# EAGLE design DummyLoad (EAGLE 7.3.0)
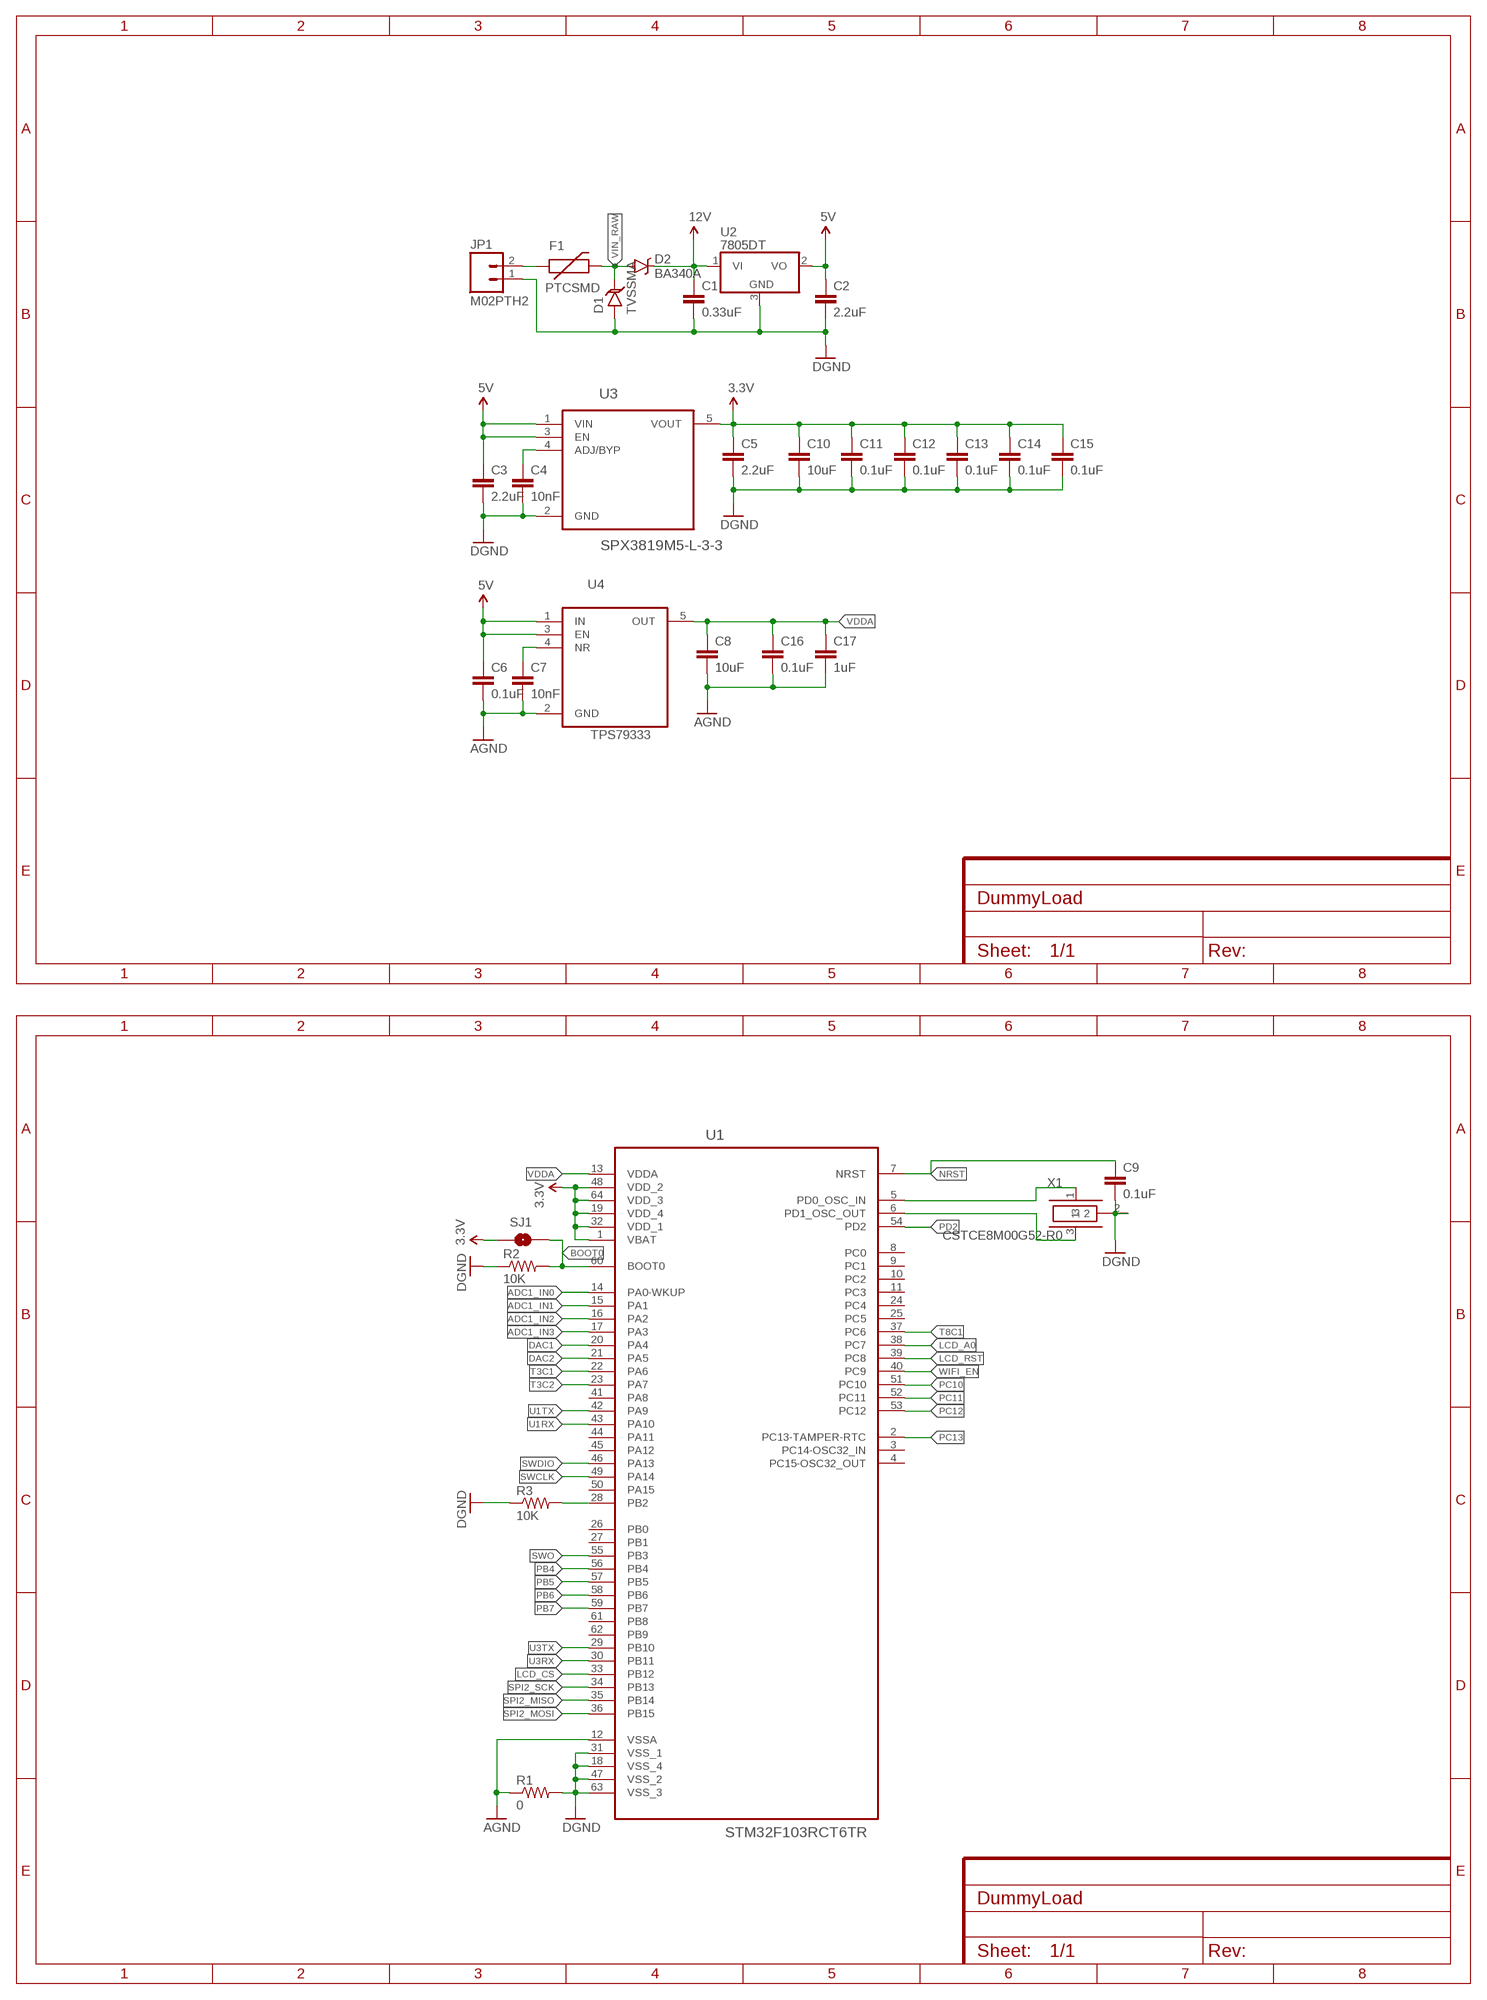
[diagram p0: schematic, sheet 1, part 1 of 2]
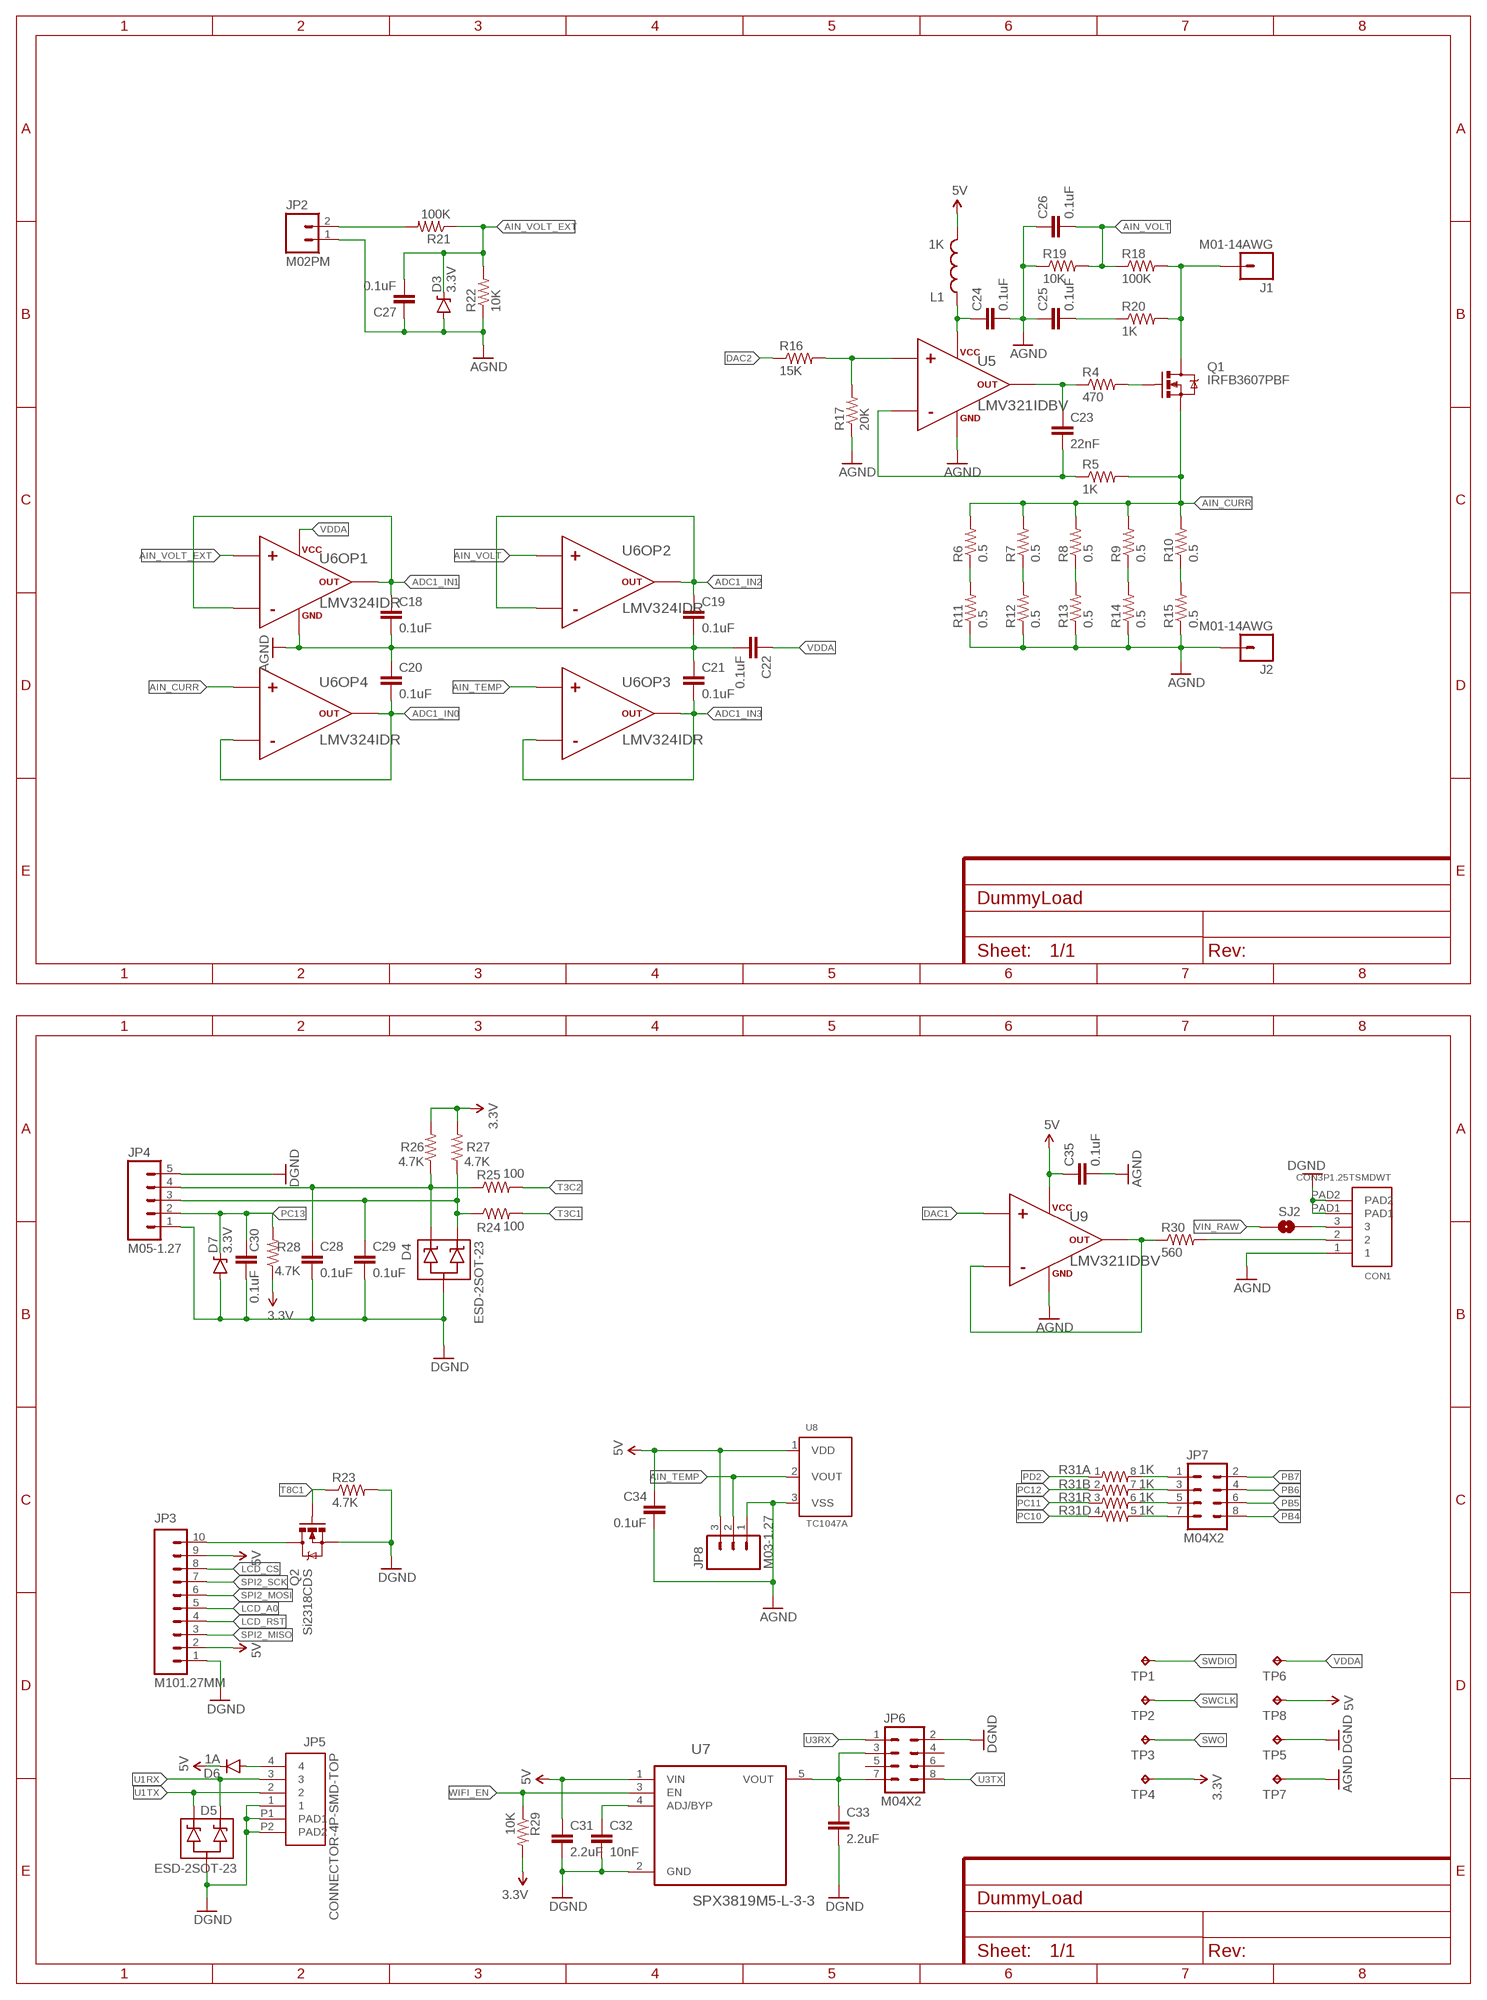
[diagram p1: schematic, sheet 1, part 2 of 2]
FRAME1 (FRAME-A4L): CNAME: Power Supply
FRAME2 (FRAME-A4L): CNAME: STM32F103
FRAME3 (FRAME-A4L): CNAME: OpAmp & Load
FRAME4 (FRAME-A4L): CNAME: Connectors

## Parts
C1  0.33uF  CAP0603-CAP  [0603-CAP]
C2  2.2uF  CAP0603-CAP  [0603-CAP]
C3  2.2uF  CAP0603-CAP  [0603-CAP]
C4  10nF  CAP0603-CAP  [0603-CAP]
C5  2.2uF  CAP0603-CAP  [0603-CAP]
C6  0.1uF  CAP0603-CAP  [0603-CAP]
C7  10nF  CAP0603-CAP  [0603-CAP]
C8  10uF  CAP0603-CAP  [0603-CAP]
C9  0.1uF  CAP0603-CAP  [0603-CAP]
C10  10uF  CAP0603-CAP  [0603-CAP]
C11  0.1uF  CAP0603-CAP  [0603-CAP]
C12  0.1uF  CAP0603-CAP  [0603-CAP]
C13  0.1uF  CAP0603-CAP  [0603-CAP]
C14  0.1uF  CAP0603-CAP  [0603-CAP]
C15  0.1uF  CAP0603-CAP  [0603-CAP]
C16  0.1uF  CAP0603-CAP  [0603-CAP]
C17  1uF  CAP0603-CAP  [0603-CAP]
C18  0.1uF  CAP0603-CAP  [0603-CAP]
C19  0.1uF  CAP0603-CAP  [0603-CAP]
C20  0.1uF  CAP0603-CAP  [0603-CAP]
C21  0.1uF  CAP0603-CAP  [0603-CAP]
C22  0.1uF  CAP0603-CAP  [0603-CAP]
C23  22nF  CAP0603-CAP  [0603-CAP]
C24  0.1uF  CAP0603-CAP  [0603-CAP]
C25  0.1uF  0.1UF-25V-5%(0603)  [0603-CAP]
C26  0.1uF  0.1UF-25V-5%(0603)  [0603-CAP]
C27  0.1uF  0.1UF-25V-5%(0603)  [0603-CAP]
C28  0.1uF  CAP0603-CAP  [0603-CAP]
C29  0.1uF  CAP0603-CAP  [0603-CAP]
C30  0.1uF  CAP0603-CAP  [0603-CAP]
C31  2.2uF  CAP0603-CAP  [0603-CAP]
C32  10nF  CAP0603-CAP  [0603-CAP]
C33  2.2uF  CAP0603-CAP  [0603-CAP]
C34  0.1uF  CAP0603-CAP  [0603-CAP]
C35  0.1uF  CAP0603-CAP  [0603-CAP]
CON1  CON3P1.25TSMDWT  [1.25T3P]
D1  TVSSMA  [SMA-DIODE]
D2  BA340A  B340A  [SMA-DIODE]
D3  3.3V  DIODE-ZENER3.3V  [SOD-323]
D4  ESD-2SOT-23  [SOT23-3]
D5  ESD-2SOT-23  [SOT23-3]
D6  1A  DIODESOD123  [SOD-123]
D7  3.3V  DIODE-ZENER3.3V  [SOD-323]
F1  PTCSMD  [PTC-1206]
J1  M01-14AWG  [PTH1.8MM]
J2  M01-14AWG  [PTH1.8MM]
JP1  M02PTH2  [1X02_BIG]
JP2  M02PM  [1X02_PM]
JP3  M101.27MM  [1X10-1.27MM]
JP4  M05-1.27  M051.27MM  [1X05-1.27MM]
JP5  CONNECTOR-4P-SMD-TOP  [PH2-4T]
JP6  M04X2  [2X4]
JP7  M04X2  [2X4]
JP8  M03-1.27  M03M03-1.27MM  [1X03-1.27MM]
L1  1K  INDUCTOR0603  [0603]
Q1  IRFB3607PBF  MOSFET-NCHANNELFQP30N06L  [TO220V]
Q2  Si2318CDS  MOSFET-NCHANNELBSS123LT1G  [SOT23-3]
R1  0  0OHM-1/10W-5%(0603)  [0603]
R2  10K  RESISTOR0603-RES  [0603-RES]
R3  10K  RESISTOR0603-RES  [0603-RES]
R4  470  RESISTOR0603-RES  [0603-RES]
R5  1K  RESISTOR0603-RES  [0603-RES]
R6  0.5  RESISTOR2512  [R2512]
R7  0.5  RESISTOR2512  [R2512]
R8  0.5  RESISTOR2512  [R2512]
R9  0.5  RESISTOR2512  [R2512]
R10  0.5  RESISTOR2512  [R2512]
R11  0.5  RESISTOR2512  [R2512]
R12  0.5  RESISTOR2512  [R2512]
R13  0.5  RESISTOR2512  [R2512]
R14  0.5  RESISTOR2512  [R2512]
R15  0.5  RESISTOR2512  [R2512]
R16  15K  RESISTOR0603-RES  [0603-RES]
R17  20K  RESISTOR0603-RES  [0603-RES]
R18  100K  RESISTOR0603-RES  [0603-RES]
R19  10K  RESISTOR0603-RES  [0603-RES]
R20  1K  RESISTOR0603-RES  [0603-RES]
R21  100K  RESISTOR0603-RES  [0603-RES]
R22  10K  RESISTOR0603-RES  [0603-RES]
R23  4.7K  RESISTOR0603-RES  [0603-RES]
R24  100  RESISTOR0603-RES  [0603-RES]
R25  100  RESISTOR0603-RES  [0603-RES]
R26  4.7K  RESISTOR0603-RES  [0603-RES]
R27  4.7K  RESISTOR0603-RES  [0603-RES]
R28  4.7K  RESISTOR0603-RES  [0603-RES]
R29  10K  10KOHM-1/10W-1%(0603)0603  [0603-RES]
R30  560  RESISTOR0603-RES  [0603-RES]
R31  1K  RESISTOR-ARRAY0603-ARV  [0603-ARV]
SJ1  JUMPER-PAD-2-NOYES_SILK  [PAD-JUMPER-2-NO_YES_SILK]
SJ2  JUMPER-PAD-2-NO  [PAD-JUMPER-2-NO_NO_SILK]
TP1  TPB1,27  [B1,27]
TP2  TPB1,27  [B1,27]
TP3  TPB1,27  [B1,27]
TP4  TPB1,27  [B1,27]
TP5  TPB1,27  [B1,27]
TP6  TPB1,27  [B1,27]
TP7  TPB1,27  [B1,27]
TP8  TPB1,27  [B1,27]
U1  STM32F103RCT6TR  [QFP50P1200X1200X160-64N]
U2  7805DT  [TO252]
U3  SPX3819M5-L-3-3  [SOT95P280X145-5N]
U4  TPS79333  [SOT95P280X145-5N]
U5  LMV321IDBV  [SOT23-5]
U6  LMV324IDR  [SOIC14]
U7  SPX3819M5-L-3-3  [SOT95P280X145-5N]
U8  TC1047A  [SOT23]
U9  LMV321IDBV  [SOT23-5]
X1  CSTCE8M00G52-R0  [CSTCE_M_G]

## Nets
3.3V: C5.1 C10.1 C11.1 C12.1 C13.1 C14.1 C15.1 R26.2 R27.2 R28.1 R29.2 SJ1.1 TP4.TP U1.1(VBAT) U1.19(VDD_4) U1.32(VDD_1) U1.48(VDD_2) U1.64(VDD_3) U3.5(VOUT)
5V: C2.1 C3.1 C6.1 C31.1 C34.1 C35.1 D6.C JP3.2 JP3.9 JP8.3 L1.2 TP8.TP U2.2(VO) U3.1(VIN) U3.3(EN) U4.1(IN) U4.3(EN) U7.1(VIN) U8.1(VDD) U9.5(VCC+)
12V: C1.1 D2.C U2.1(VI)
ADC1_IN0: C20.2 U1.14(PA0-WKUP) U6.13(OP4:-) U6.14(OP4:OUT)
ADC1_IN1: C18.1 U1.15(PA1) U6.1(OP1:OUT) U6.2(OP1:-)
ADC1_IN2: C19.1 U1.16(PA2) U6.6(OP2:-) U6.7(OP2:OUT)
ADC1_IN3: C21.2 U1.17(PA3) U6.8(OP3:OUT) U6.9(OP3:-)
AGND: C6.2 C7.2 C8.2 C16.2 C17.2 C18.2 C19.2 C20.1 C21.1 C22.2 C24.2 C25.1 C26.1 C27.1 C34.2 C35.2 CON1.1 D3.A J2.1 JP2.1 JP8.1 R1.1 R11.1 R12.1 R13.1 R14.1 R15.1 R17.1 R19.1 R22.1 TP7.TP U1.12(VSSA) U4.2(GND) U5.2(GND) U6.11(OP1:GND) U8.3(VSS) U9.2(GND)
AIN_CURR: Q1.3(S) R5.2 R6.2 R7.2 R8.2 R9.2 R10.2 U6.12(OP4:+)
AIN_TEMP: JP8.2 U6.10(OP3:+) U8.2(VOUT)
AIN_VOLT: C26.2 R18.1 R19.2 U6.5(OP2:+)
AIN_VOLT_EXT: C27.2 D3.C R21.1 R22.2 U6.3(OP1:+)
BOOT0: R2.2 SJ1.2 U1.60(BOOT0)
BOOT1: R3.2 U1.28(PB2)
DAC1: U1.20(PA4) U9.1(+)
DAC2: R16.1 U1.21(PA5)
GND: C1.2 C2.2 C3.2 C4.2 C5.2 C9.2 C10.2 C11.2 C12.2 C13.2 C14.2 C15.2 C28.2 C29.2 C30.2 C31.2 C32.2 C33.2 CON1.PAD1 CON1.PAD2 D1.A D4.3(C) D5.3(C) D7.A JP1.1 JP3.1 JP4.1 JP4.5 JP5.1 JP5.P1(PAD1) JP5.P2(PAD2) JP6.2 Q2.2(S) R1.2 R2.1 R3.1 R23.2 TP5.TP U1.18(VSS_4) U1.31(VSS_1) U1.47(VSS_2) U1.63(VSS_3) U2.3(GND) U3.2(GND) U7.2(GND) X1.2 ; supply symbol labelled DGND
LCD_A0: JP3.5 U1.38(PC7)
LCD_CS: JP3.8 U1.33(PB12)
LCD_RST: JP3.4 U1.39(PC8)
N$1: F1.1 JP1.2
N$2: CON1.3 SJ2.2
N$3: C4.1 U3.4(ADJ/BYP)
N$4: C7.1 U4.4(NR)
N$5: JP3.10 Q2.3(D)
N$6: U1.5(PD0_OSC_IN) X1.1
N$7: U1.6(PD1_OSC_OUT) X1.3
N$8: C23.1 R4.1 U5.4(OUT)
N$9: Q1.1(G) R4.2
N$10: C25.2 R20.1
N$11: C23.2 R5.1 U5.3(-)
N$12: R6.1 R11.2
N$13: R7.1 R12.2
N$14: R8.1 R13.2
N$15: R9.1 R14.2
N$16: R10.1 R15.2
N$17: R16.2 R17.2 U5.1(+)
N$18: C29.1 D4.2(A2) JP4.3 R24.1 R27.1
N$19: JP2.2 R21.2
N$20: C24.1 L1.1 U5.5(VCC+)
N$21: C28.1 D4.1(A1) JP4.4 R25.1 R26.1
N$22: D6.A JP5.4
N$23: C33.1 JP6.3 JP6.7 U7.5(VOUT)
N$25: C32.1 U7.4(ADJ/BYP)
N$26: R30.1 U9.3(-) U9.4(OUT)
N$27: CON1.2 R30.2
N$30: JP7.1 R31.8
N$31: JP7.3 R31.7
N$32: JP7.5 R31.6
N$33: JP7.7 R31.5
NRST: C9.1 U1.7(NRST)
PB4: JP7.8 U1.56(PB4)
PB5: JP7.6 U1.57(PB5)
PB6: JP7.4 U1.58(PB6)
PB7: JP7.2 U1.59(PB7)
PC10: R31.4 U1.51(PC10)
PC11: R31.3 U1.52(PC11)
PC12: R31.2 U1.53(PC12)
PC13: C30.1 D7.C JP4.2 R28.2 U1.2(PC13-TAMPER-RTC)
PD2: R31.1 U1.54(PD2)
SPI2_MISO: JP3.3 U1.35(PB14)
SPI2_MOSI: JP3.6 U1.36(PB15)
SPI2_SCK: JP3.7 U1.34(PB13)
SWCLK: TP2.TP U1.49(PA14)
SWDIO: TP1.TP U1.46(PA13)
SWO: TP3.TP U1.55(PB3)
T3C1: R24.2 U1.22(PA6)
T3C2: R25.2 U1.23(PA7)
T8C1: Q2.1(G) R23.1 U1.37(PC6)
U1RX: D5.1(A1) JP5.3 U1.43(PA10)
U1TX: D5.2(A2) JP5.2 U1.42(PA9)
U3RX: JP6.1 U1.30(PB11)
U3TX: JP6.8 U1.29(PB10)
V_LOAD: J1.1 Q1.2(D) R18.2 R20.2
VDDA: C8.1 C16.1 C17.1 C22.1 TP6.TP U1.13(VDDA) U4.5(OUT) U6.4(OP1:VCC+)
VIN_RAW: D1.C D2.A F1.2 SJ2.1
WIFI_EN: R29.1 U1.40(PC9) U7.3(EN)
Unconnected: JP6.4 JP6.5 JP6.6 U1.3(PC14-OSC32_IN) U1.4(PC15-OSC32_OUT) U1.8(PC0) U1.9(PC1) U1.10(PC2) U1.11(PC3) U1.24(PC4) U1.25(PC5) U1.26(PB0) U1.27(PB1) U1.41(PA8) U1.44(PA11) U1.45(PA12) U1.50(PA15) U1.61(PB8) U1.62(PB9)

## Library data of the parts
C1-C24 C28-C35 = SparkFun-Capacitors:CAP: Capacitor Standard 0603 ceramic capacitor, and 0.1" leaded capacitor.
C25-C27 = SparkFun-Capacitors:0.1UF-25V-5%(0603): CAP-08604; PROD_ID: CAP-08604
CON1 = szjlc:CON3P
D1 = SparkFun-DiscreteSemi:TVS: Transient voltage suppressor- prevents ESD on inputs.
D2 = SparkFun-DiscreteSemi:B340A: Schottky Diode 3A-40V; PROD_ID: DIO-09886
D3 D7 = SparkFun-DiscreteSemi:DIODE-ZENER: Zener Diode Production Part - 8199 3.4V Zener Voltage; PROD_ID: DIO-11284
D4 D5 = SparkFun-DiscreteSemi:ESD-2
D6 = SparkFun-DiscreteSemi:DIODE: Diode These are standard reverse protection diodes and small signal diodes. SMA package can handle up to about 1A. SOD-323 can handle about 200mA. What the SOD-323 package when ordering, there are some mfgs out there that are 5-pin packages.
F1 = SparkFun-PowerIC:PTC: Resettable Fuse PTC Resettable Fuse. Spark Fun Electronics SKU : COM-08357; PROD_ID: RES-11150
J1 J2 = SparkFun-Connectors:M01: Header 1 Standard 1-pin 0.1" header. Use with straight break away headers (SKU : PRT-00116), right angle break away headers (PRT-00553), swiss pins (PRT-00743), machine pins (PRT-00117), and female headers (PRT-00115).
JP1 JP2 = SparkFun-Connectors:M02: Standard 2-pin 0.1" header. Use with - straight break away headers ( PRT-00116) - right angle break away headers (PRT-00553) - swiss pins (PRT-00743) - machine pins (PRT-00117) - female headers (PRT-00115) Molex polarized connector foot print use with: PRT-08233 with associated crimp pins and housings. 2.54_SCREWTERM for use with PRT-10571. 3.5mm Screw Terminal footprints for PRT-08084 5mm Screw Terminal footprints for use with PRT-08432
JP3 = SparkFun-Connectors:M10: Header 10 Standard 10-pin 0.1" header. Use with straight break away headers (SKU : PRT-00116), right angle break away headers (PRT-00553), swiss pins (PRT-00743), machine pins (PRT-00117), and female headers (PRT-00115).
JP4 = SparkFun-Connectors:M05: Header 5 Standard 5-pin 0.1" header. Use with straight break away headers (SKU : PRT-00116), right angle break away headers (PRT-00553), swiss pins (PRT-00743), machine pins (PRT-00117), and female headers (PRT-00115). Molex polarized connector foot print use with SKU : PRT-08230 with associated crimp pins and housings.
JP5 = connectors:CONNECTOR-4P-SMD
JP6 JP7 = SparkFun-Connectors:M04X2: .1" header, two rows of four.
JP8 = SparkFun-Connectors:M03: Header 3 Standard 3-pin 0.1" header. Use with straight break away headers (SKU : PRT-00116), right angle break away headers (PRT-00553), swiss pins (PRT-00743), machine pins (PRT-00117), and female headers (PRT-00115). Molex polarized connector foot print use with SKU : PRT-08232 with associated crimp pins and housings.
L1 = SparkFun-Passives:INDUCTOR: Inductors Basic Inductor/Choke - 0603 and 1206. Footprints are not proven and vary greatly between part numbers. SRN6045- 33uH, 20% 1.4A SDR0403-560KL - 56uH, 10%, 500mA RMS/740mA peak
Q1 = SparkFun-DiscreteSemi:MOSFET-NCHANNEL: Common NMOSFET Parts MFG P/N Store ID Prod ID FDD8780 TRANS-09984 SI7820DN TRANS-11055 FDS6630A IC-08089 2N7002PW TRANS-11151 FQP30N06L COM-10213 TRANS-10060 BSS123LT1G TRANS-08345 BSS138 TRANS-00830 BS170 2N7000; PROD_ID: TRANS-10060
Q2 = SparkFun-DiscreteSemi:MOSFET-NCHANNEL: Common NMOSFET Parts MFG P/N Store ID Prod ID FDD8780 TRANS-09984 SI7820DN TRANS-11055 FDS6630A IC-08089 2N7002PW TRANS-11151 FQP30N06L COM-10213 TRANS-10060 BSS123LT1G TRANS-08345 BSS138 TRANS-00830 BS170 2N7000; PROD_ID: TRANS-08345
R1 = SparkFun-Resistors:0OHM-1/10W-5%(0603): RES-08609; PROD_ID: RES-08609
R2-R28 = SparkFun-Resistors:RESISTOR: Resistor Basic schematic elements and footprints for 0603, 1206, and PTH resistors.
R29 = SparkFun-Resistors:10KOHM-1/10W-1%(0603): RES-00824; PROD_ID: RES-00824
R30 = SparkFun-Passives:RESISTOR: Resistor Basic schematic elements and footprints for 0603, 1206, and PTH resistors.
R31 = SparkFun-Resistors:RESISTOR-ARRAY: Array Chip Resistor Source: RS Component / Phycomp
SJ1 SJ2 = SparkFun-Passives:JUMPER-PAD-2-NO
TP1-TP8 = testpad:TP: Test pad
U1 = STM32F103xCDE:STM32F103RCT6: ARM-based 32-bit MCU; MPN: STM32F103RCT6; OC_FARNELL: 1624136; OC_NEWARK: 01P4099; PACKAGE: QFP-64; SUPPLIER: STMICROELECTRONICS
U2 = adafruit:78*: Positive VOLTAGE REGULATOR Added bigger pads to the TO-92 package
U3 U7 = szjlc:SPX3819M5-L-3-3: 500mA, LOW-NOISE LDO VOLTAGE REGULATOR; MPN: SPX3819M5-L-3-3; OC_FARNELL: 1831949; OC_NEWARK: 23R9702; PACKAGE: SOT-23-5; SUPPLIER: EXAR
U4 = LDO:TPS79333: LOW-DROPOUT LINEAR REGULATORS; MPN: TPS79333DBVR; OC_FARNELL: 1470478; OC_NEWARK: 77C1365; PACKAGE: SOT-23-5; SUPPLIER: Texas Instruments
U5 U9 = opamp:LMV321I: LOW-VOLTAGE RAIL-TO-RAIL OUTPUT OPERATIONAL AMPLIFIERS; MPN: LMV321IDBVR; OC_FARNELL: 1105935; OC_NEWARK: 97K3150; PACKAGE: SOT-23-5; SUPPLIER: Texas Instruments
U6 = opamp:LMV324I
U8 = ti_misc:TC1047
X1 = murata:CSTCE8M00G52-R0

## Board
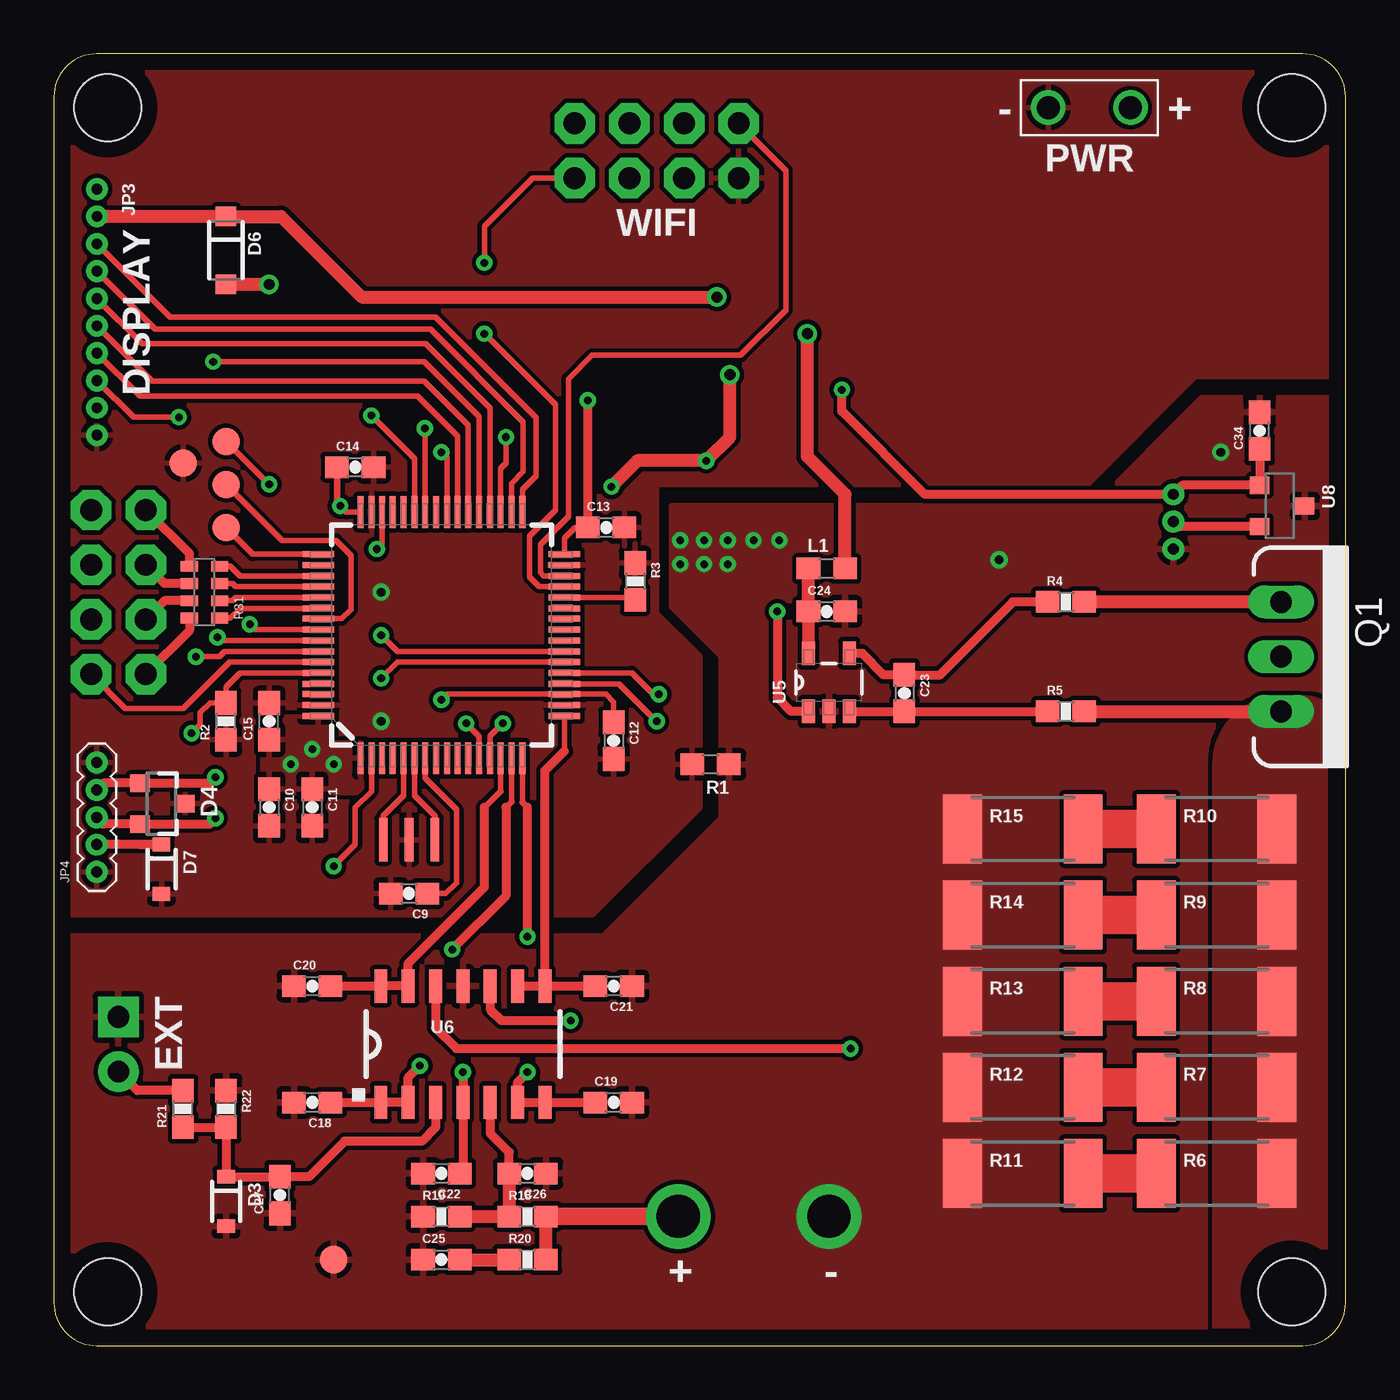
[diagram p2: board, top side]
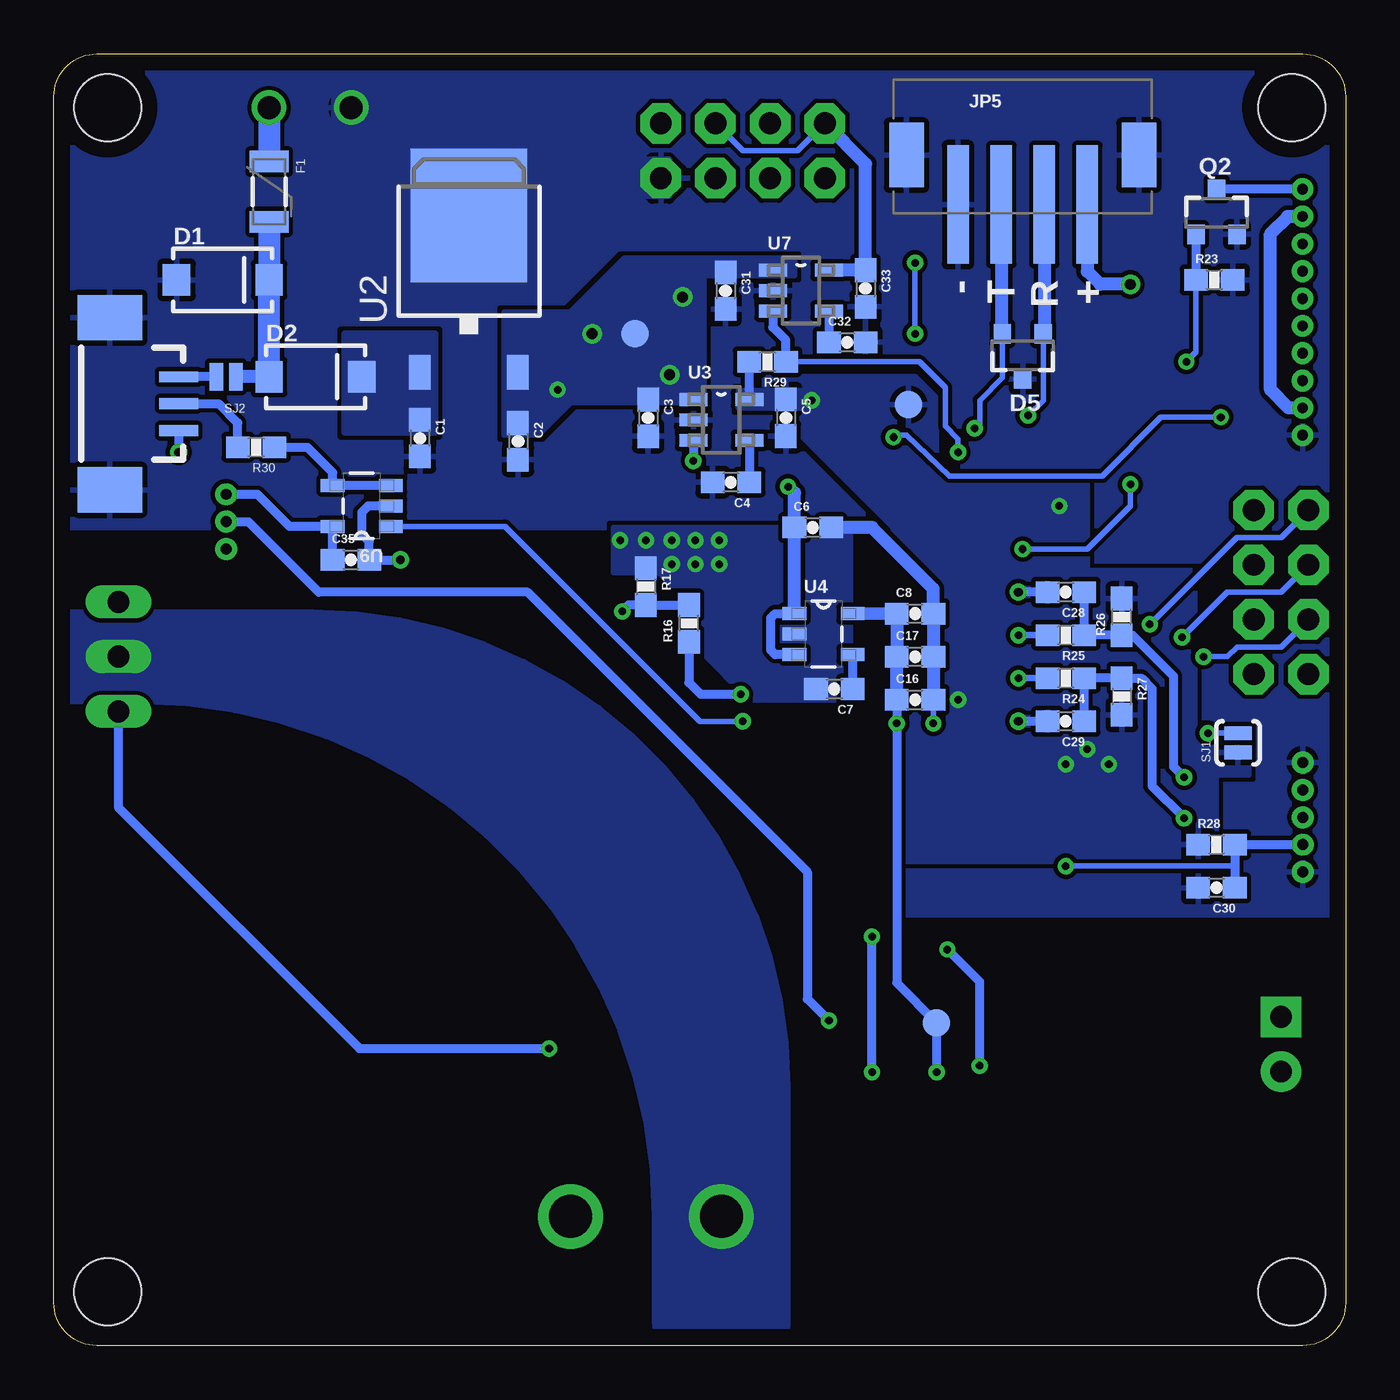
[diagram p3: board, bottom side, seen from below]

Size 60 x 60 mm. Coordinates in mm from the lower left corner, seen from the top.
Outline: 0,2 arc90 2,0 58,0 arc90 60,2 60,58 arc90 58,60 2,60 arc90 0,58 0,2
Copper layers (1*16): Top 0.035mm / dielectric 1.5mm / Bottom 0.035mm
Design rules "default *": minimum track width 10mil, minimum drill 0.3mm, track to track 8mil, track to pad 8mil, pad to pad 8mil, via to via 8mil, smd to smd 8mil, copper to edge 30mil, drill to drill 8mil, minimum pad ring 10mil, minimum via ring 8mil, stop-mask expansion 4mil, vias tented up to drill 0mil, thermal gap 10mil
Holes 3.1 mm at 2.5,2.5 57.5,57.5 57.5,2.5 2.5,57.5

### Footprints (pad centres in the part's own frame; a part is rotated, then mirrored left to right if it is on the bottom)
0603-CAP = smd 1.1 x 1: 1 -0.85,0; 2 0.85,0
1.25T3P = smd 0.5 x 1.8: 1 -1.25,-1.8; 2 0,-1.8; 3 1.25,-1.8 | smd 2.1 x 3: PAD1 -4,1.4; PAD2 4,1.4
SMA-DIODE = smd 1.27 x 1.47: A -2.15,0; C 2.15,0
SOD-323 = smd 0.63 x 0.83: A 1.15,0; C -1.15,0
SOT23-3 = smd 0.8 x 0.9: 1 -0.95,-1; 2 0.95,-1; 3 0,1.1
SOD-123 = smd 0.9 x 0.95: A 1.575,0; C -1.575,0
PTC-1206 = smd 1 x 1.8: 1 -1.4,0; 2 1.4,0
PTH1.8MM = drill 2: 1 0,0
1X02_BIG = drill 1.067: 1 0,0; 2 3.81,0
1X02_PM = drill 1.016 pad 1.88 square: 1 -1.27,0 | drill 1.016 pad 1.88: 2 1.27,0
1X10-1.27MM = drill 0.503: 1 5.715,0; 2 4.445,0; 3 3.175,0; 4 1.905,0; 5 0.635,0; 6 -0.635,0; 7 -1.905,0; 8 -3.175,0; 9 -4.445,0; 10 -5.715,0
1X05-1.27MM = drill 0.508 pad 1: 1 0,0; 2 1.27,0; 3 2.54,0; 4 3.81,0; 5 5.08,0
PH2-4T = smd 1 x 5.5: 1 -3,-2; 2 -1,-2; 3 1,-2; 4 3,-2 | smd 1.6 x 3: P1 -5.4,0.3; P2 5.4,0.3
2X4 = drill 1.016 pad 1.88 octagon: 1 -3.81,-1.27; 2 -3.81,1.27; 3 -1.27,-1.27; 4 -1.27,1.27; 5 1.27,-1.27; 6 1.27,1.27; 7 3.81,-1.27; 8 3.81,1.27
1X03-1.27MM = drill 0.508 pad 1: 1 0,0; 2 1.27,0; 3 2.54,0
0603 = smd 1.1 x 1: 1 -0.85,0; 2 0.85,0
TO220V = drill 1.016 long: 1 -2.54,0; 2 0,0; 3 2.54,0
0603-RES = smd 1.1 x 1: 1 -0.85,0; 2 0.85,0
R2512 = smd 1.8 x 3.2: 1 -2.8,0; 2 2.8,0
0603-ARV = smd 0.5 x 0.8: 1 -1.2,-0.7; 2 -0.4,-0.7; 3 0.4,-0.7; 4 1.2,-0.7; 5 1.2,0.7; 6 0.4,0.7; 7 -0.4,0.7; 8 -1.2,0.7
PAD-JUMPER-2-NO_YES_SILK = smd 0.635 x 1.27: 1 -0.45,0; 2 0.45,0
PAD-JUMPER-2-NO_NO_SILK = smd 0.635 x 1.27: 1 -0.45,0; 2 0.45,0
B1,27 = smd 1.27 x 1.27: TP 0,0
QFP50P1200X1200X160-64N = smd 1.473 x 0.279: 1 -5.715,3.759; 2 -5.715,3.251; 3 -5.715,2.743; 4 -5.715,2.261; 5 -5.715,1.753; 6 -5.715,1.245; 7 -5.715,0.762; 8 -5.715,0.254; 9 -5.715,-0.254; 10 -5.715,-0.762; 11 -5.715,-1.245; 12 -5.715,-1.753; 13 -5.715,-2.261; 14 -5.715,-2.743; 15 -5.715,-3.251; 16 -5.715,-3.759; 33 5.715,-3.759; 34 5.715,-3.251; 35 5.715,-2.743; 36 5.715,-2.261; 37 5.715,-1.753; 38 5.715,-1.245; 39 5.715,-0.762; 40 5.715,-0.254; 41 5.715,0.254; 42 5.715,0.762; 43 5.715,1.245; 44 5.715,1.753; 45 5.715,2.261; 46 5.715,2.743; 47 5.715,3.251; 48 5.715,3.759 | smd 0.279 x 1.473: 17 -3.759,-5.715; 18 -3.251,-5.715; 19 -2.743,-5.715; 20 -2.261,-5.715; 21 -1.753,-5.715; 22 -1.245,-5.715; 23 -0.762,-5.715; 24 -0.254,-5.715; 25 0.254,-5.715; 26 0.762,-5.715; 27 1.245,-5.715; 28 1.753,-5.715; 29 2.261,-5.715; 30 2.743,-5.715; 31 3.251,-5.715; 32 3.759,-5.715; 49 3.759,5.715; 50 3.251,5.715; 51 2.743,5.715; 52 2.261,5.715; 53 1.753,5.715; 54 1.245,5.715; 55 0.762,5.715; 56 0.254,5.715; 57 -0.254,5.715; 58 -0.762,5.715; 59 -1.245,5.715; 60 -1.753,5.715; 61 -2.261,5.715; 62 -2.743,5.715; 63 -3.251,5.715; 64 -3.759,5.715
TO252 = smd 1 x 1.6: 1 -2.28,-4.8; 2 2.28,-4.8 | smd 5.4 x 6.2: 3 0,2.5
SOT95P280X145-5N = smd 1.3 x 0.6: 1 -1.3,0.95; 2 -1.3,0; 3 -1.3,-0.95; 4 1.3,-0.95; 5 1.3,0.95
SOT95P280X145-5N' = smd 1.1 x 0.6: 1 -1.35,0.95; 2 -1.35,0; 3 -1.35,-0.95; 4 1.35,-0.95; 5 1.35,0.95
SOT23-5 = smd 1.1 x 0.6: 1 -1.35,0.95; 2 -1.35,0; 3 -1.35,-0.95; 4 1.35,-0.95; 5 1.35,0.95
SOIC14 = smd 0.6 x 1.55: 1 -3.81,-2.7; 2 -2.54,-2.7; 3 -1.27,-2.7; 4 0,-2.7; 5 1.27,-2.7; 6 2.54,-2.7; 7 3.81,-2.7; 8 3.81,2.7; 9 2.54,2.7; 10 1.27,2.7; 11 0,2.7; 12 -1.27,2.7; 13 -2.54,2.7; 14 -3.81,2.7
SOT23 = smd 0.8 x 0.9: 1 -0.96,-1; 2 0.96,-1; 3 0,1.1
CSTCE_M_G = smd 0.4 x 2: 1 -1.2,0; 2 0,0; 3 1.2,0

### Placement (x,y rotation side)
C1  43,42.15 270 bottom
C2  38.44,42 270 bottom
C3  32.4,43.09 270 bottom
C4  28.55,40.1 180 bottom
C5  26,43.1 270 bottom
C6  24.75,38 0 bottom
C7  23.75,30.5 180 bottom
C8  20,34 0 bottom
C9  16.5,21 180 top
C10  10,25 270 top
C11  12,25 270 top
C12  26,28.1 270 top
C13  25.65,38 0 top
C14  14,40.8 0 top
C15  10,29 90 top
C16  20,30 0 bottom
C17  20,32 0 bottom
C18  12,11.3 180 top
C19  26,11.3 0 top
C20  12,16.7 0 top
C21  26,16.7 180 top
C22  18,8 180 top
C23  39.5,30.31 270 top
C24  35.9,34.1 0 top
C25  18,4 0 top
C26  22,8 180 top
C27  10.5,7 90 top
C28  13,35 180 bottom
C29  13,29 180 bottom
C30  6,21.27 180 bottom
C31  28.8,49 270 bottom
C32  23.15,46.6 0 bottom
C33  22.3,49.1 270 bottom
C34  56,42.5 90 top
C35  46.2,36.5 0 bottom
CON1  56,43.75 90 bottom
D1  52.15,49.5 0 bottom
D2  47.85,45 0 bottom
D3  8,6.7 270 top
D4  5,25.18 270 top
D5  15,46 180 bottom
D6  8,50.87 270 top
D7  5,22.13 270 top
F1  50,53.6 270 bottom
J1  29,6 0 top
J2  36,6 90 top
JP1  46.19,57.5 0 top
JP2  3,14 270 top
JP3  2,48 270 top
JP4  2,22 90 top
JP5  15,55 0 bottom
JP6  28,55.5 180 top
JP7  3,35 90 top
JP8  52,37 90 top
L1  35.9,36.1 0 top
Q1  57,32 270 top
Q2  6,52.62 0 bottom
R1  30.5,27 180 top
R2  8,29 90 top
R3  27,35.5 270 top
R4  47,34.54 0 top
R5  47,29.46 0 top
R6  54,8 0 top
R7  54,12 0 top
R8  54,16 0 top
R9  54,20 0 top
R10  54,24 0 top
R11  45,8 0 top
R12  45,12 0 top
R13  45,16 0 top
R14  45,20 0 top
R15  45,24 0 top
R16  30.5,33.55 90 bottom
R17  32.5,35.25 270 bottom
R18  22,6 0 top
R19  18,6 0 top
R20  22,4 0 top
R21  6,11 90 top
R22  8,11 270 top
R23  6.1,49.5 0 bottom
R24  13,31 180 bottom
R25  13,33 180 bottom
R26  10.4,33.85 90 bottom
R27  10.4,30.15 270 bottom
R28  6,23.27 0 bottom
R29  26.85,45.7 180 bottom
R30  50.6,41.73 180 bottom
R31  7,35 90 top
SJ1  5,28 90 bottom
SJ2  52,45 180 bottom
TP1  8,42 0 top
TP2  8,38 0 top
TP3  8,40 0 top
TP4  20.3,43.7 0 bottom
TP5  6,41 0 top
TP6  19,15 0 bottom
TP7  13,4 0 top
TP8  33,47 0 bottom
U1  18,33 90 top
U2  40.72,50 0 bottom
U3  29,43 0 bottom
U4  TPS79333  [SOT95P280X145-5N']  24.25,33.05 0 bottom
U5  36,30.81 90 top
U6  19,14 0 top
U7  25.3,49 0 bottom
U8  57,39 270 top
U9  45.7,39 180 bottom
X1  16.5,23.5 0 top

### Tracks (layer width: path | path; a pad name or v marks a point on that pad's centre or on a via)
3.3V  (via drill 0.35)
  Top 0.254: U1.48 13.59,38.72 v13.3,39 | v18,30 18.26,30.26 U1.19 25.64,30.26 26,29.9 C12.1 | U1.32 23.71,37.52 24.2,38 C13.1
  Top 0.305: C14.1 13.15,39.15 v13.3,39
  Top 0.406: C13.1 v24.8,43.9
  Bottom 0.406: U3.5 R29.2
  other vias: 12,27.7 13,27 11,27
  pour Bottom (rank 2): 27,45 20,45 19,44 19,41 18,40 12,40 12,36 7,36 7,28 4.5,28 4.5,26.5 6,26.5 6,22.5 21,22.5 21,38 26,43 27,43
  pour Top: 12.9,29.2 9.7,29.2 9.7,25.7 14.3,25.7 14.3,28 12.9,28
  pour Bottom (no thermals): 24.3,44.35 28.2,44.35 28.2,43.55 24.3,43.55
5V  (via drill 0.35, 0.5)
  Top 0.406: v36.6,44.4 36.6,43.4 40.46,39.54 JP8.3 52.42,39.96 U8.1 C34.1
  Top 0.61: v35,47 35,41.3 36.75,39.55 L1.2 | JP3.9 D6.C 10.55,52.45 14.3,48.7 v30.8,48.7 | v31.4,45.1 31.4,42.2 v30.3,41.1 27.1,41.1 v25.9,39.9
  Bottom 0.406: U3.3 v30.3,41.1 | 25.6,34.2 U4.1 26.5,34 26.7,33.8 26.7,32.3 26.5,32.1 U4.3 | JP8.3 50.54,39.54 49.05,38.05 U9.5 C35.1
  Bottom 0.61: JP3.2 2.65,43.55 3.5,44.4 3.5,51.65 2.7,52.45 JP3.9 | v25.9,39.9 25.6,39.6 C6.1 25.6,34.2
  pour Bottom (no thermals): 39.1,48 36,48 33.5,50.5 25.6,50.5 25.6,49.7 29.8,49.7 29.8,43.8 36,43.8 37.5,42.3 39.1,42.3
12V
  pour Bottom (no thermals): 42.3,42.4 42.3,47 46.5,47 46.5,42.4
ADC1_IN0
  Top 0.254: U1.14 20.74,25.74
  Top 0.305: 20.74,25.74 20,25
  Top 0.406: 20,25 20,21.3 16.46,17.76 U6.13 U6.14 C20.2
ADC1_IN1  (via drill 0.35)
  Top 0.254: U1.15 21.25,25.25
  Top 0.305: 21.25,25.25 21,25
  Top 0.406: v17,13 16.46,12.46 U6.2 U6.1 C18.1 | 21,25 21,20.9 v18.5,18.4
  Bottom 0.406: v17,13 17,16.9 v18.5,18.4
ADC1_IN2  (via drill 0.35)
  Top 0.254: U1.16 21.76,25.24
  Top 0.305: 21.76,25.24 22,25
  Top 0.406: v22,19 22,25 | C19.1 U6.7 U6.6 21.54,12.24 v22,12.7
  Bottom 0.406: v22,12.7 v22,19
ADC1_IN3
  Top 0.254: U1.17 23.71,27.61
  Top 0.406: 23.71,27.61 22.81,26.71 U6.8 | U6.9 U6.8 | U6.8 C21.2
AGND  (via drill 0.35, 0.4)
  Top 0.254: U1.12 19.75,28.3 v19.15,28.9
  Bottom 0.254: C16.2 v19.15,28.9
  Bottom 0.406: CON1.1 v54.2,41.5 | U9.2 45.4,39 45.7,38.7 45.7,37.7 45.35,37.35 C35.2 v43.9,36.5
  Bottom 0.61: C16.2 C17.2 C8.2 19.15,35.15 22,38 C6.2
  other vias: 30.2,36.3 30.2,37.4 31.3,37.4 32.5,37.4 29.1,36.3 29.1,37.4 31.3,36.3 33.7,37.4
  pour Top (rank 3): 0,0 60,0 60,44 53.3,44 48.3,39 28.7,39 28.7,34.3 31,32 31,24.5 25.5,19 0,19
  pour Top (no thermals): 34,12 34,0 45,0 45,27 40,27 40,12
  pour Bottom (rank 2, no thermals): 23,30 23,38 34,38 34,35.9 31.9,35.9 31.3,35.3 30,35.3 30,32.3 27.7,30
AIN_CURR  (via drill 0.35)
  Top 0.406: U6.12 17.73,14.77 18.7,13.8 v37,13.8
  Top 0.61: R5.2 Q1.3
  Bottom 0.406: Q1.3 57,25 45.8,13.8 v37,13.8
  pour Top (isolate 0.813, no thermals): 58,30 57,30 arc90 54,27 54,0 60,0 60,28 arc90
AIN_TEMP  (via drill 0.35)
  Top 0.406: U6.10 20.27,15.63 20.8,15.1 v24,15.1 | U8.2 52.23,38.04 JP8.2
  Bottom 0.406: v24,15.1 25,16.1 25,22 38,35 47.7,35 50.97,38.27 JP8.2
AIN_VOLT
  Top 0.406: C26.2 21.15,8.99 20.27,9.87 U6.5
  Top 0.61: R19.2 R18.1 C26.2
AIN_VOLT_EXT
  Top 0.406: R21.1 R22.2 D3.C C27.2 11.85,7.85 13.5,9.5 17.1,9.5 17.73,10.13 U6.3
BOOT0  (via drill 0.35)
  Top 0.254: U1.60 8.65,31.25 8,30.6 R2.2 7.25,29.85 6.8,29.4 6.8,28.85 v6.4,28.45
  Bottom 0.254: SJ1.2 v6.4,28.45
BOOT1
  Top 0.254: U1.28 26.65,34.75 26.75,34.65 R3.2
DAC1  (via drill 0.35)
  Top 0.254: U1.20 26.26,30.74 v28,29
  Bottom 0.254: v28,29 30,29 39.05,38.05 U9.1
DAC2  (via drill 0.35)
  Top 0.254: U1.21 26.85,31.25 27.85,30.25 v28.1,30.25
  Bottom 0.406: R16.1 30.5,30.8 29.95,30.25 v28.1,30.25
GND  (via drill 0.4)
  Bottom 0.406: C28.2 v15.2,35 | C29.2 v15.2,29
  pour Top (rank 6): 0,20 25,20 30,25 30,32 28,34 28,40 48,40 53,45 60,45 60,60 0,60
  pour Bottom (rank 4): 0,20 0,60 60,60 60,38 22,38 22,20
  pour Bottom (rank 4, no thermals): 39,59 35.1,55.1 31.4,55.1 31.4,53.4 35,53.4 37,51.4 37,49 47,49 47,59
LCD_A0
  Top 0.254: U1.38 19.25,42.76 17.2,44.8 4.57,44.8 JP3.5
LCD_CS
  Top 0.254: U1.33 21.76,39.76 22.4,40.4 22.4,43.1 17.73,47.77 5.4,47.77 JP3.8
LCD_RST
  Top 0.254: U1.39 18.76,42.24 16.91,44.09 4,44.09 JP3.4
N$1
  Bottom 0.406: F1.1 50,55.4
  Bottom 1.016: JP1.2 50,55.4
N$2
  Bottom 0.406: SJ2.2 CON1.3
N$3
  Bottom 0.406: U3.4 C4.1
N$4
  Bottom 0.406: U4.4 C7.1
N$5
  Bottom 0.406: JP3.10 Q2.3
N$6
  Top 0.254: U1.5 16.25,25.55 15.3,24.6 X1.1
N$7
  Top 0.254: U1.6 16.75,25.55 17.7,24.6 X1.3
N$8
  Top 0.406: U5.4 37.54,32.16 38.54,31.16 C23.1 41.16,31.16 44.54,34.54 R4.1
N$9
  Top 0.61: Q1.1 R4.2
N$10
  Top 0.61: C25.2 R20.1
N$11
  Top 0.406: U5.3 C23.2 R5.1
N$12
  Top 1.778: R11.2 R6.1
N$13
  Top 1.778: R12.2 R7.1
N$14
  Top 1.778: R13.2 R8.1
N$15
  Top 1.778: R14.2 R9.1
N$16
  Top 1.778: R15.2 R10.1
N$17  (via drill 0.35)
  Top 0.406: U5.1 34.24,29.46 33.6,30.1 v33.6,34.1
  Bottom 0.406: R16.2 R17.2 33.3,34.4 v33.6,34.1
N$18  (via drill 0.35)
  Top 0.406: JP4.3 2.31,24.23 D4.2 7.22,24.23 v7.5,24.5
  Bottom 0.406: C29.1 R24.1 R27.1 9.5,31 9,30.5 9,26 v7.5,24.5
N$19
  Top 0.406: R21.2 3.88,11.85 JP2.2
N$20
  Top 0.58: U5.5 C24.1
  Top 0.61: C24.1 L1.1
N$21  (via drill 0.35)
  Top 0.406: JP4.4 2.31,26.12 D4.1 7.22,26.12 v7.5,26.4
  Bottom 0.406: C28.1 R25.1 R26.1 9.9,33 8,31.1 8,26.9 v7.5,26.4
N$22  (via drill 0.5)
  Top 0.61: D6.A v10,49.3
  Bottom 0.61: JP5.4 12,49.9 11.39,49.3 v10,49.3
N$23
  Bottom 0.254: JP6.3 28,55.5 25.46,55.5 JP6.7
  Bottom 0.6: C33.1 U7.5
  Bottom 0.61: C33.1 22.3,54.88 JP6.7
N$24
  cutout Bottom (no thermals): 24.5,38.4 25.1,38.4 25.1,37.6 24.5,37.6
N$25
  Bottom 0.406: U7.4 C32.1
N$26
  Bottom 0.406: U9.3 U9.4 47.05,40.55 48.23,41.73 R30.1
N$27
  Bottom 0.406: CON1.2 52.35,43.75 51.45,42.85 R30.2
N$30
  Top 0.406: R31.8 6.3,33.22 JP7.1
N$31
  Top 0.406: R31.7 5.14,34.6 JP7.3
N$32
  Top 0.406: R31.6 5.14,35.4 JP7.5
N$33
  Top 0.406: R31.5 6.3,36.78 JP7.7
NRST
  Top 0.254: U1.7 17.24,26.36 18.7,24.9 18.7,21.5 18.2,21 C9.1
PB4  (via drill 0.35)
  Top 0.254: U1.56 9.35,33.25 v9.1,33.5
  Bottom 0.254: JP7.8 3,37.54 5.06,37.54 v9.1,33.5
PB5  (via drill 0.35)
  Top 0.254: U1.57 7.75,32.75 v7.6,32.9
  Bottom 0.254: v7.6,32.9 5.5,35 3,35 JP7.6
PB6  (via drill 0.35)
  Top 0.254: U1.58 7.94,32.24 7.7,32 v6.6,32
  Bottom 0.254: v6.6,32 5.5,32 5.04,32.46 3,32.46 JP7.4
PB7
  Top 0.254: U1.59 8.15,31.75 6,29.6 3.32,29.6 JP7.2
PC10
  Top 0.254: U1.51 8.66,35.74 8.2,36.2 R31.4
PC11
  Top 0.254: U1.52 8.44,35.26 8.3,35.4 R31.3
PC12
  Top 0.254: U1.53 8.45,34.75 8.3,34.6 R31.2
PC13  (via drill 0.35)
  Top 0.254: U1.2 14.75,25.75 14,25 14,23.27 v13,22.27
  Top 0.406: JP4.2 D7.C 4.01,23.27
  Bottom 0.254: v13,22.27 5.15,22.27
  Bottom 0.406: JP4.2 R28.2 5.15,22.27 C30.1
PD2
  Top 0.254: U1.54 8.64,34.24 8.2,33.8 R31.1
SPI2_MISO  (via drill 0.35)
  Top 0.254: U1.35 20.74,40.74 21,41 v21,42.2 | v5.8,43.12 3.7,43.12 JP3.3
  Bottom 0.254: v5.8,43.12 8.57,43.12 11.3,40.4 18.4,40.4 20.4,42.3 20.9,42.3 v21,42.2
SPI2_MOSI
  Top 0.254: U1.36 20.26,43.54 17.27,46.53 4.1,46.53 JP3.6
SPI2_SCK
  Top 0.254: U1.34 21.25,40.05 21.8,40.6 21.8,42.9 17.5,47.2 4.7,47.2 JP3.7
SWCLK
  Top 0.254: U1.49 9.24,36.76 TP2.TP
SWDIO  (via drill 0.35)
  Top 0.254: U1.46 15.26,37.26 v15,37 | v10,40 TP1.TP
  Bottom 0.254: v15,37 12,37 10,39 v10,40
SWO
  Top 0.254: U1.55 13.36,33.76 13.8,34.2 13.8,36.7 13.1,37.4 10.6,37.4 TP3.TP
T3C1  (via drill 0.35)
  Top 0.254: U1.22 15.96,31.75 v15.2,31
  Bottom 0.305: R24.2 v15.2,31
T3C2  (via drill 0.35)
  Top 0.254: U1.23 15.96,32.24 v15.2,33
  Bottom 0.305: R25.2 v15.2,33
T8C1  (via drill 0.35)
  Top 0.254: U1.37 19.75,43.15 17.2,45.7 v7.4,45.7
  Bottom 0.254: R23.1 6.95,46.15 v7.4,45.7
  Bottom 0.406: Q2.1 R23.1
U1RX  (via drill 0.35)
  Top 0.254: U1.43 16.75,41.2 v14.75,43.2
  Bottom 0.254: D5.1 14.05,43.9 v14.75,43.2
  Bottom 0.61: JP5.3 14,47.05 D5.1
U1TX  (via drill 0.35)
  Top 0.254: U1.42 v17.24,42.6
  Bottom 0.254: D5.2 15.95,44.95 17,43.9 17,42.84 v17.24,42.6
  Bottom 0.61: JP5.2 16,47.05 D5.2
U3RX
  Top 0.254: U1.30 22.76,35.74 22.6,35.9 22.6,37.2 23.9,38.5 23.9,44.9 25,46 31.9,46 34,48.1 34,54.58 JP6.1
U3TX  (via drill 0.35)
  Top 0.254: U1.29 22.54,35.26 22.1,35.7 22.1,37.6 23.3,38.8 23.3,43.7 v20,47 | v20,50.3 20,52 22.23,54.23 JP6.8
  Bottom 0.254: v20,50.3 v20,47
V_LOAD
  Top 0.61: R20.2 R18.2
  Top 0.813: J1.1 R18.2
  pour Bottom (no thermals): 60,34 48,34 arc90 26,12 26,1 arc90 27,0 31,0 arc90 32,1 32,6 arc-90 56,30 60,30
VDDA  (via drill 0.35)
  Top 0.254: U1.13 20.26,28.31 v20.85,28.9
  Top 0.406: v19,12.7 U6.4 19,8.15 C22.1
  Bottom 0.406: C16.1 v20.85,28.9 20.85,16.85 TP6.TP v19,12.7
  Bottom 0.58: C8.1 U4.5
  Bottom 0.61: C16.1 C17.1 C8.1
VIN_RAW
  Bottom 0.406: F1.2 50,51.8
  Bottom 0.61: D2.A SJ2.1
  Bottom 1.016: 50,51.8 D1.C D2.A
WIFI_EN  (via drill 0.35)
  Top 0.254: U1.40 18.25,41.25 v18,41.5
  Bottom 0.254: v18,41.5 18,42.1 18.6,42.7 18.6,44.5 19.8,45.7 R29.1
  Bottom 0.406: U7.3 26.6,47.3 26,46.7 R29.1

### Text on the board
tPlace: - | + | PWR | WIFI | DISPLAY | EXT | + | -
bPlace: + | R | T | -